# EAGLE design HB-OU-MP3-LED_V1.0 (EAGLE 9.3.1)
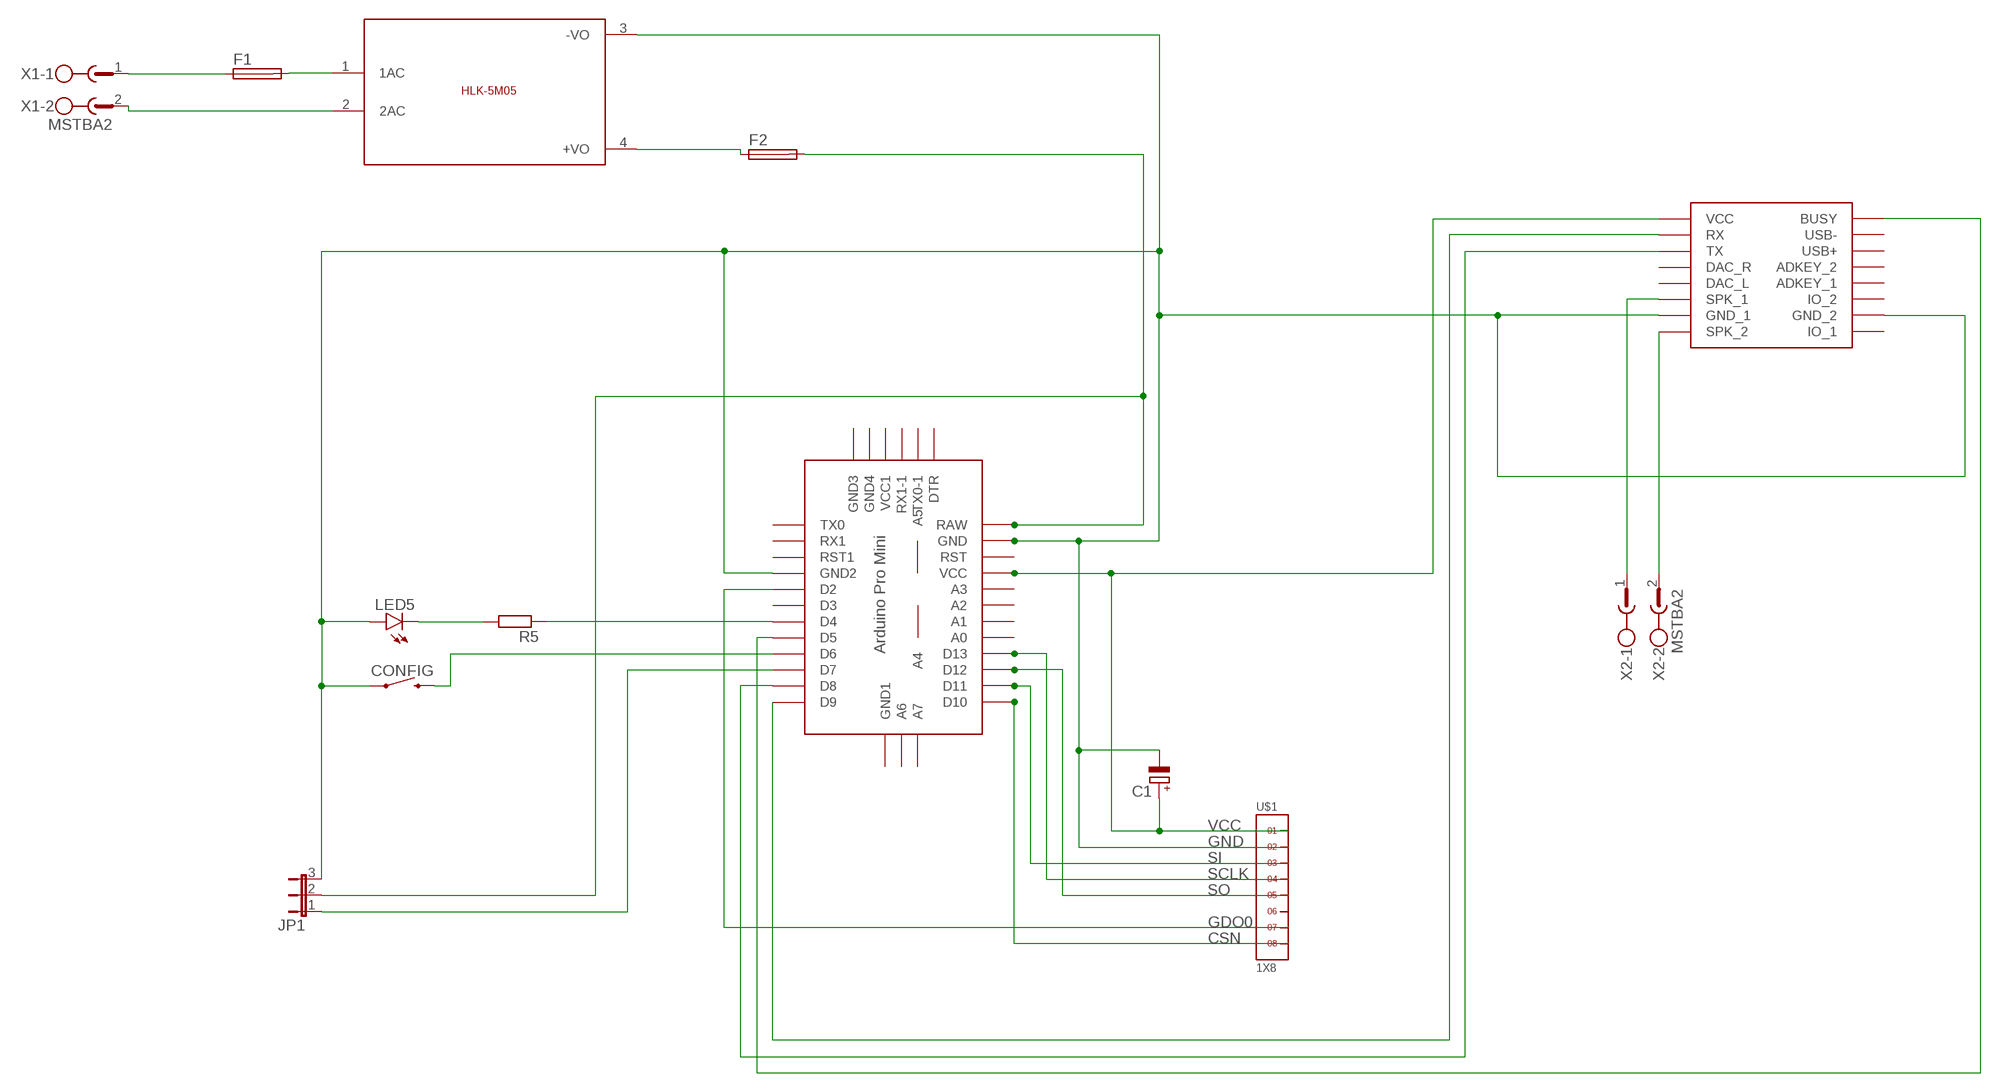
[diagram p0: schematic, sheet 1]

## Parts
C1  CPOL-EUE2.5-5  [E2,5-5]
CONFIG  MOMENTARY-SWITCH-SPST-PTH-6.0MM-KIT  [TACTILE_SWITCH_PTH_6.0MM_KIT]
F1  SH22,5A  [SH22,5A]
F2  SH22,5A  [SH22,5A]
JP1  JP2E  [JP2]
LED5  LED3MM  [LED3MM]
R5  R-EU_0309/10  [0309/10]
U$1  1X8  [1X8]
U$2  ABK-PRO-MINI  [ABK-PRO-MINI]
U$3  5VDC/5W  HLK-5M05  [HLK-5M05]
U$4  DFPLAYER  [DFPLAYER]
X1  MSTBA2  [MSTBA2]
X2  MSTBA2  [MSTBA2]

## Nets
CSN: U$1.8 U$2.D10
GDO0: U$1.7 U$2.D2
GND: C1.- CONFIG.1 JP1.3 LED5.A U$1.2 U$2.GND U$2.GND1(GND2) U$3.3(-VO) U$4.GND_1 U$4.GND_2
N$1: JP1.1 U$2.D7
N$2: CONFIG.3 U$2.D6
N$3: U$2.D9 U$4.RX
N$4: U$2.D8 U$4.TX
N$5: U$2.D5 U$4.BUSY
N$6: U$4.SPK1(SPK_1) X2.1
N$7: U$4.SPK2(SPK_2) X2.2
N$9: F1.1 X1.1
N$10: F2.1 U$3.4(+VO)
N$11: U$3.2(2AC) X1.2
N$17: R5.1 U$2.D4
N$18: LED5.K(C) R5.2
N$19: F1.2 U$3.1(1AC)
N$24: F2.2 JP1.2 U$2.RAW
SCLK: U$1.4 U$2.D13
SI: U$1.3 U$2.D11
SO: U$1.5 U$2.D12
VCC: C1.+ U$1.1 U$2.VCC U$4.VCC
Unconnected: U$1.6 U$2.A0 U$2.A1 U$2.A2 U$2.A3 U$2.A4 U$2.A5 U$2.A6 U$2.A7 U$2.D3 U$2.DTR U$2.GND2(GND3) U$2.GND3(GND4) U$2.GND4(GND1) U$2.RST U$2.RST1 U$2.RX1 U$2.RX1-1 U$2.TX0 U$2.TX0-1 U$2.VCC1 U$4.ADKEY1(ADKEY_1) U$4.ADKEY2(ADKEY_2) U$4.DAC_L U$4.DAC_R U$4.IO1(IO_1) U$4.IO2(IO_2) U$4.USB+ U$4.USB-

## Library data of the parts
C1 = resistor:CPOL-EU: POLARIZED CAPACITOR, European symbol
CONFIG = SparkFun-Switches:MOMENTARY-SWITCH-SPST: Momentary Switch (Pushbutton) - SPST Normally-open (NO) SPST momentary switches (buttons, pushbuttons). Variants PTH-12MM - 12mm square, through-hole Momentary Pushbutton Switch - 12mm Square <https://www.sparkfun.com/products/9190> (COM-09190) PTH-6.0MM, PTH-6.0MM-KIT - 6.0mm square, through-hole Mini Pushbutton Switch <https://www.sparkfun.com/products/97> (COM-00097) KIT package intended for soldering kit's - only one side of pads' copper is exposed. PTH-RIGHT-ANGLE-KIT - Right-angle, through-hole Right Angle Tactile Button <https://www.sparkfun.com/products/10791> - Used on SparkFun BigTime Watch Kit <https://www.sparkfun.com/products/11734> SMD-12MM - 12mm square, surface-mount Tactile Button - SMD (12mm) <https://www.sparkfun.com/products/12993> (COM-12993) Used on SparkFun PicoBoard <https://www.sparkfun.com/products/11888> SMD-4.5MM - 4.5mm Square Trackball Switch Used on SparkFun Blackberry Trackballer Breakout <https://www.sparkfun.com/products/13169> SMD-4.6MMX2.8MM - 4.60mm x 2.80mm, surface mount Used on SparkFun SAMD21 Mini Breakout <https://www.sparkfun.com/products/13664> SMD-5.2MM, SMD-5.2-REDUNDANT - 5.2mm square, surface-mount Mini Pushbutton Switch - SMD <https://www.sparkfun.com/products/8720> (COM-08720) Used on Arduino Pro Mini <https://www.sparkfun.com/products/11114> REDUNDANT package connects both switch circuits together SMD-6.0X3.5MM - 6.0 x 3.5mm, surface mount Momentary Reset Switch SMD <https://www.sparkfun.com/products/8229> (COM-08229) SMD-6.2MM-TALL - 6.2mm square, surface mount Tactile Button - SMD (6mm) <https://www.sparkfun.com/products/12992> Used on SparkFun Digital Sandbox <https://www.sparkfun.com/products/12651> SMD-RIGHT-ANGLE - Right-angle, surface mount Used on SparkFun Block for Intel® Edison - Arduino <https://www.sparkfun.com/products/13036>; PROD_ID: SWCH-08441; SF_SKU: COM-00097
F1 F2 = fuse:SH22,5A: FUSE HOLDER grid 22,5mm, isolated cap OGN0031 8201, Schurter (Buerklin); MPN: 0031.7701.11; OC_FARNELL: unknown; OC_NEWARK: 04F1224
JP1 = jumper:JP2E: JUMPER
LED5 = led:LED: LED OSRAM: - CHIPLED LG R971, LG N971, LY N971, LG Q971, LY Q971, LO R971, LY R971 LH N974, LH R974 LS Q976, LO Q976, LY Q976 LO Q996 - Hyper CHIPLED LW Q18S LB Q993, LB Q99A, LB R99A - SideLED LS A670, LO A670, LY A670, LG A670, LP A670 LB A673, LV A673, LT A673, LW A673 LH A674 LY A675 LS A676, LA A676, LO A676, LY A676, LW A676 LS A679, LY A679, LG A679 - Hyper Micro SIDELED® LS Y876, LA Y876, LO Y876, LY Y876 LT Y87S - SmartLED LW L88C, LW L88S LB L89C, LB L89S, LG L890 LS L89K, LO L89K, LY L89K LS L896, LA L896, LO L896, LY L896 - TOPLED LS T670, LO T670, LY T670, LG T670, LP T670 LSG T670, LSP T670, LSY T670, LOP T670, LYG T670 LG T671, LOG T671, LSG T671 LB T673, LV T673, LT T673, LW T673 LH T674 LS T676, LA T676, LO T676, LY T676, LB T676, LH T676, LSB T676, LW T676 LB T67C, LV T67C, LT T67C, LS T67K, LO T67K, LY T67K, LW E67C LS E67B, LA E67B, LO E67B, LY E67B, LB E67C, LV E67C, LT E67C LW T67C LS T679, LY T679, LG T679 LS T770, LO T770, LY T770, LG T770, LP T770 LB T773, LV T773, LT T773, LW T773 LH T774 LS E675, LA E675, LY E675, LS T675 LS T776, LA T776, LO T776, LY T776, LB T776 LHGB T686 LT T68C, LB T68C - Hyper Mini TOPLED® LB M676 - Mini TOPLED Santana® LG M470 LS M47K, LO M47K, LY M47K Source: http://www.osram.convergy.de LUXEON: - LUMILED® LXK2-PW12-R00, LXK2-PW12-S00, LXK2-PW14-U00, LXK2-PW14-V00 LXK2-PM12-R00, LXK2-PM12-S00, LXK2-PM14-U00 LXK2-PE12-Q00, LXK2-PE12-R00, LXK2-PE12-S00, LXK2-PE14-T00, LXK2-PE14-U00 LXK2-PB12-K00, LXK2-PB12-L00, LXK2-PB12-M00, LXK2-PB14-N00, LXK2-PB14-P00, LXK2-PB14-Q00 LXK2-PR12-L00, LXK2-PR12-M00, LXK2-PR14-Q00, LXK2-PR14-R00 LXK2-PD12-Q00, LXK2-PD12-R00, LXK2-PD12-S00 LXK2-PH12-R00, LXK2-PH12-S00 LXK2-PL12-P00, LXK2-PL12-Q00, LXK2-PL12-R00 Source: www.luxeon.com KINGBRIGHT: KA-3528ASYC Source: www.kingbright.com
R5 = resistor:R-EU_: RESISTOR, European symbol
U$1 = headers(2mm):1X8
U$2 = Arduino-clone:ABK-PRO-MINI: ABK Pro-Mini Arduino Clone
U$3 = HLK-5M05:HLK-5M05: HLK-5M05 is an 5Volt/5W smps developed by HI-LINK; SIZE: 23x38(mm)
U$4 = DFPlayer_v1:DFPLAYER
X1 X2 = con-phoenix-508:MSTBA2: PHOENIX; MF: FARNELL; MPN: 1757242; OC_FARNELL: 3705171; OC_NEWARK: 71C4161

## Board
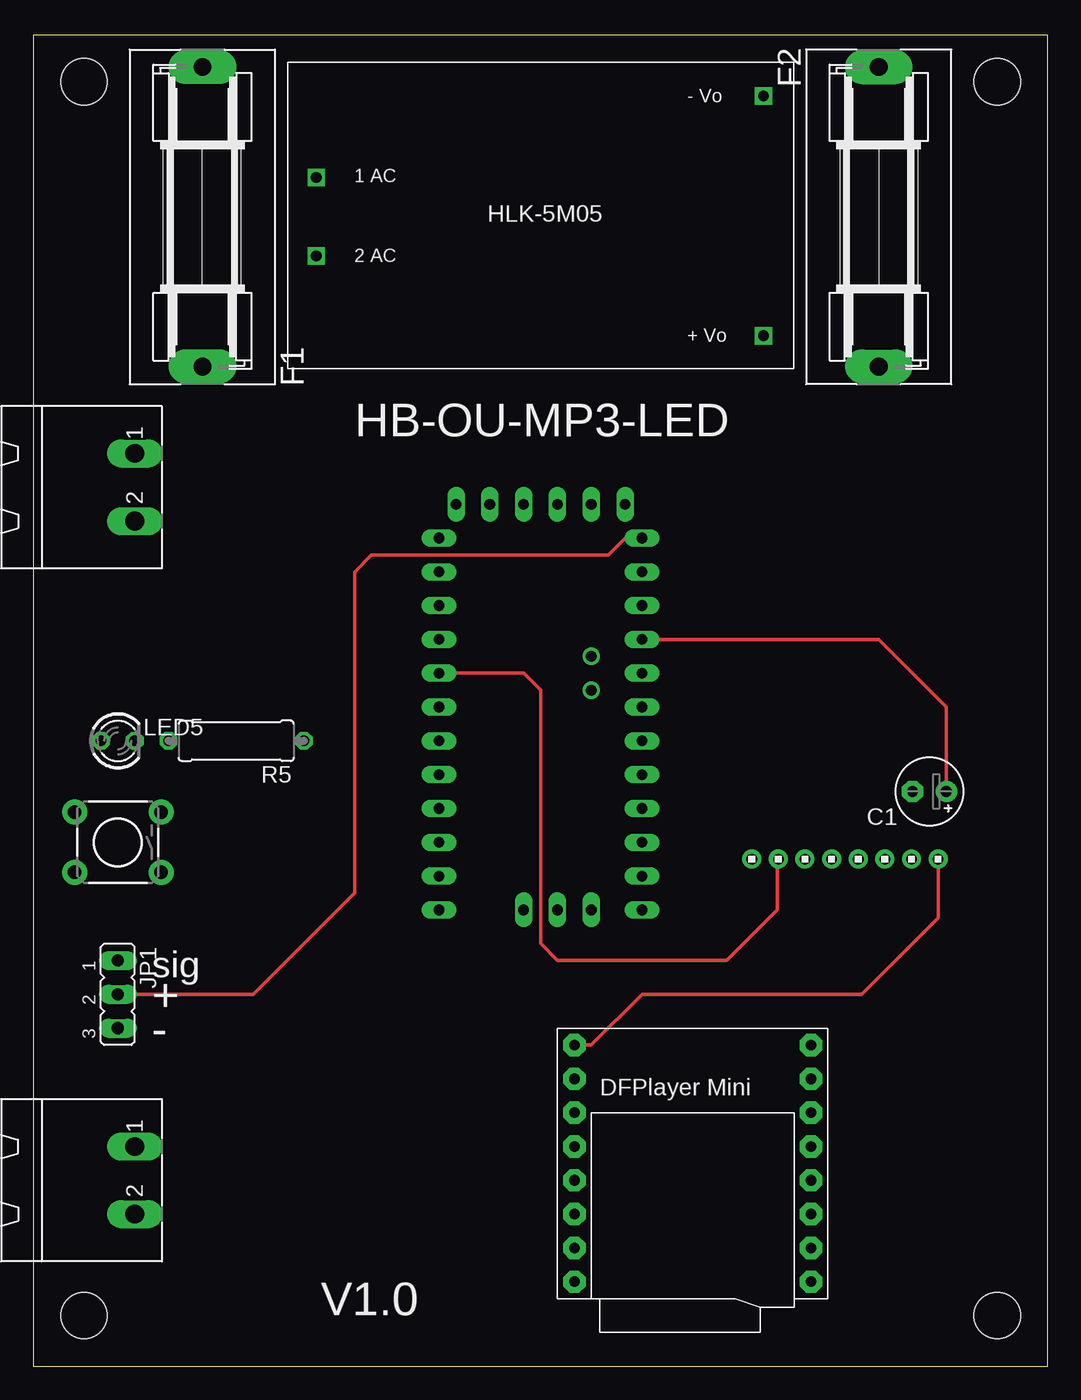
[diagram p1: board, top side]
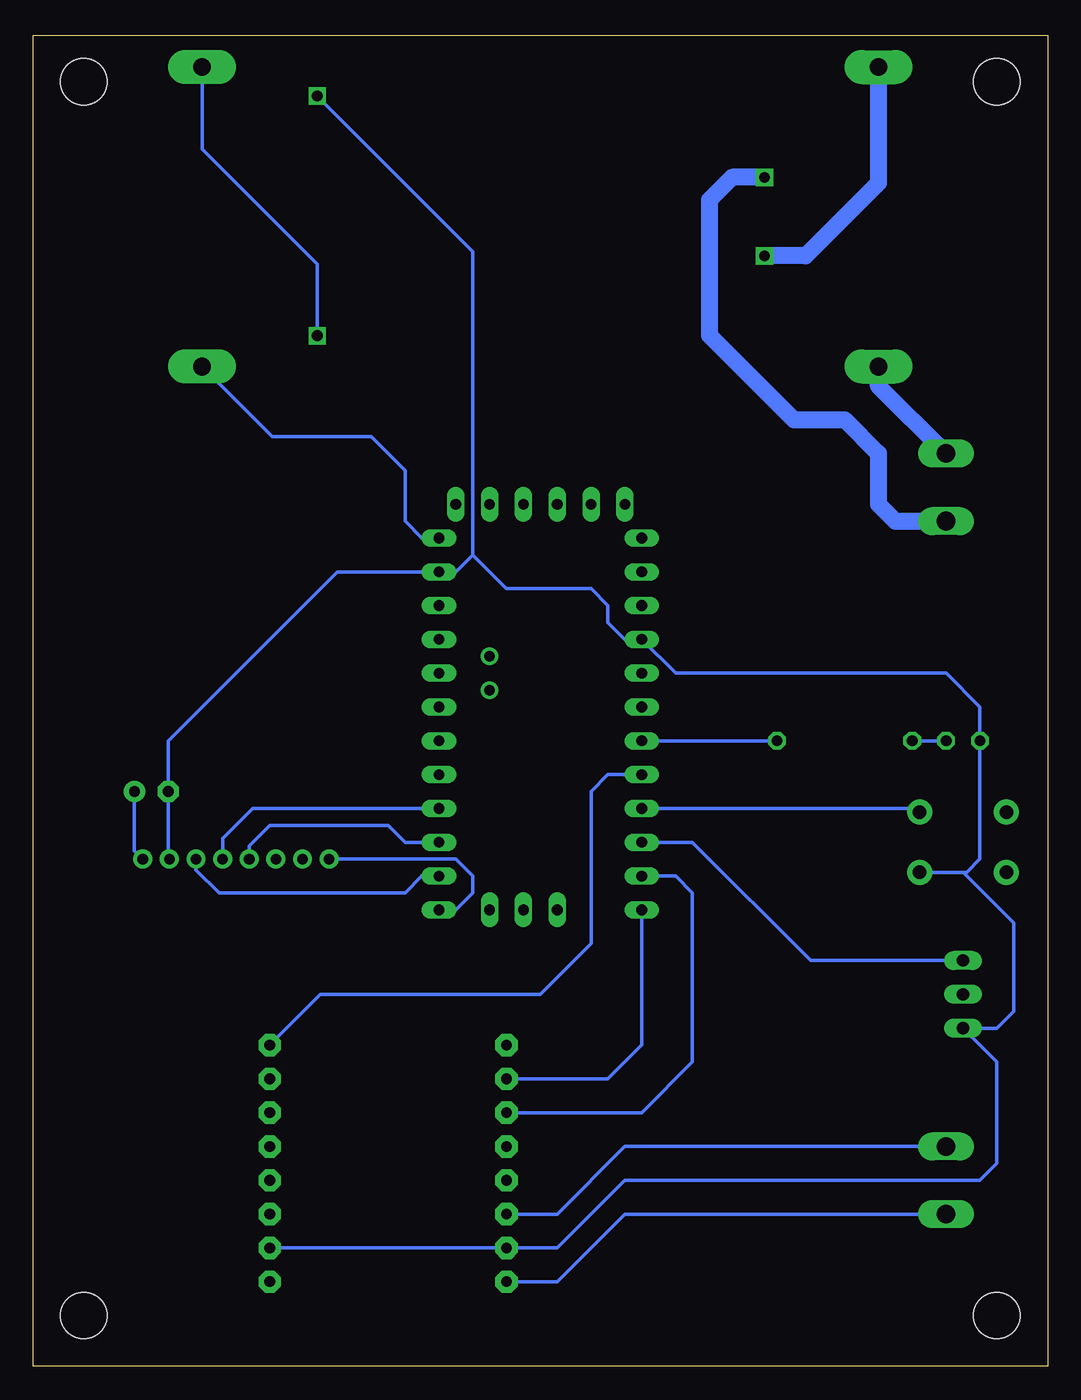
[diagram p2: board, bottom side, seen from below]

Size 76.18 x 100 mm. Coordinates in mm from the lower left corner, seen from the top.
Outline: 0,0 76.18,0 76.18,100 0,100 0,0
Copper layers (1*16): Top 0.035mm / dielectric 1.5mm / Bottom 0.035mm
Design rules "default": minimum track width 6mil, minimum drill 0.35mm, track to track 6mil, track to pad 6mil, pad to pad 6mil, via to via 6mil, smd to smd 6mil, copper to edge 40mil, drill to drill 6mil, minimum pad ring 10mil, minimum via ring 8mil, stop-mask expansion 4mil, vias tented up to drill 0mil, thermal gap 10mil
Holes 3.5 mm at 3.81,96.52 72.39,96.52 3.81,3.81 72.39,3.81

### Footprints (pad centres in the part's own frame; a part is rotated, then mirrored left to right if it is on the bottom)
E2,5-5 = drill 0.813 pad 1.6: + -1.27,0 | drill 0.813 pad 1.6 octagon: - 1.27,0
TACTILE_SWITCH_PTH_6.0MM_KIT = drill 1.016 pad 1.88: 1 -3.251,2.261; 2 3.251,2.261; 3 -3.251,-2.261; 4 3.251,-2.261
SH22,5A = drill 1.321 pad 2.54 long: 1 -11.252,0; 2 11.252,0
JP2 = drill 0.914 long: 1 -2.54,0; 2 0,0; 3 2.54,0
LED3MM = drill 0.813 octagon: A -1.27,0; K 1.27,0
0309/10 = drill 0.813 octagon: 1 -5.08,0; 2 5.08,0
1X8 = drill 0.8 pad 1.422: 1 -7,0; 2 -5,0; 3 -3,0; 4 -1,0; 5 1,0; 6 3,0; 7 5,0; 8 7,0
ABK-PRO-MINI = drill 0.8 long: A0 10.16,-3.81; A1 10.16,-6.35; A2 10.16,-8.89; A3 10.16,-11.43; A6 3.81,-21.59; A7 6.35,-21.59; D2 -5.08,-3.81; D3 -5.08,-6.35; D4 -5.08,-8.89; D5 -5.08,-11.43; D6 -5.08,-13.97; D7 -5.08,-16.51; D8 -5.08,-19.05; D9 -5.08,-21.59; D10 10.16,-21.59; D11 10.16,-19.05; D12 10.16,-16.51; D13 10.16,-13.97; DTR 8.89,8.89; GND 10.16,3.81; GND1 -5.08,-1.27; GND2 -3.81,8.89; GND3 -1.27,8.89; GND4 1.27,-21.59; RAW 10.16,6.35; RST 10.16,1.27; RST1 -5.08,1.27; RX1 -5.08,3.81; RX1-1 3.81,8.89; TX0 -5.08,6.35; TX0-1 6.35,8.89; VCC 10.16,-1.27; VCC1 1.27,8.89 | drill 0.8: A4 6.35,-5.08; A5 6.35,-2.54
HLK-5M05 = drill 0.8 square: 1 -16.85,-2.93; 2 -16.85,2.97; 3 16.75,9.07; 4 16.75,-8.93
DFPLAYER = drill 0.8 pad 1.676 octagon: ADKEY1 8.89,-1.27; ADKEY2 8.89,1.27; BUSY 8.89,8.89; DAC_L -8.89,-1.27; DAC_R -8.89,1.27; GND_1 -8.89,-6.35; GND_2 8.89,-6.35; IO1 8.89,-8.89; IO2 8.89,-3.81; RX -8.89,6.35; SPK1 -8.89,-3.81; SPK2 -8.89,-8.89; TX -8.89,3.81; USB+ 8.89,3.81; USB- 8.89,6.35; VCC -8.89,8.89
MSTBA2 = drill 1.397 long: 1 -2.54,5.08; 2 2.54,5.08

### Placement (x,y rotation side)
C1  67.31,43.18 180 top
CONFIG  6.35,39.37 180 top
F1  12.7,86.36 90 top
F2  63.5,86.36 270 top
JP1  6.35,27.94 270 top
LED5  6.35,46.99 0 top
R5  15.24,46.99 180 top
U$1  60.96,38.1 180 top
U$2  35.56,55.88 0 top
U$3  38.1,86.36 0 top
U$4  49.53,15.24 0 top
X1  2.54,66.04 270 top
X2  2.54,13.97 270 top

### Tracks (layer width: path | path; a pad name or v marks a point on that pad's centre or on a via)
CSN
  Bottom 0.254: U$2.D10 44.45,34.29 43.18,35.56 43.18,36.83 44.45,38.1 U$1.8
GDO0
  Top 0.254: U$1.7 55.88,38.02 55.88,34.29 52.07,30.48 39.37,30.48 38.1,31.75 38.1,50.8 36.83,52.07 U$2.D2
GND
  Bottom 0.254: U$4.GND_2 U$4.GND_1 36.83,8.89 31.75,13.97 5.08,13.97 3.81,15.24 3.81,22.86 JP1.3 3.81,25.4 2.54,26.67 2.54,33.3 6.35,37.11 | CONFIG.1 6.35,37.11 | 6.35,37.11 6.07,37.11 5.08,38.1 LED5.A 5.08,49.53 7.62,52.07 27.94,52.07 U$2.GND1 31.75,54.61 33.02,55.88 33.02,57.15 34.29,58.42 40.64,58.42 43.18,60.96 | U$3.3 43.18,83.76 43.18,60.96 | 43.18,60.96 44.45,59.69 U$2.GND 53.34,59.69 66.04,46.99 C1.- 66.04,38.18 U$1.2
N$1
  Bottom 0.254: U$2.D7 26.67,39.37 17.78,30.48 JP1.1
N$2
  Bottom 0.254: CONFIG.3 9.88,41.91 U$2.D6
N$3
  Bottom 0.254: U$2.D9 30.48,24.13 33.02,21.59 U$4.RX
N$4
  Bottom 0.254: U$2.D8 27.94,36.83 26.67,35.56 26.67,22.86 30.48,19.05 U$4.TX
N$5
  Bottom 0.254: U$4.BUSY 54.61,27.94 38.1,27.94 34.29,31.75 34.29,43.18 33.02,44.45 U$2.D5
N$6
  Bottom 0.254: X2.1 31.75,16.51 36.83,11.43 U$4.SPK1
N$7
  Bottom 0.254: X2.2 31.75,11.43 36.83,6.35 U$4.SPK2
N$9
  Bottom 1.27: X1.1 12.7,73.66 F1.1
N$10
  Bottom 0.254: U$3.4 54.85,82.79 63.5,91.44 F2.1
N$11
  Bottom 1.27: U$3.2 23.7,89.33 25.4,87.63 25.4,77.47 19.05,71.12 15.24,71.12 12.7,68.58 12.7,64.77 11.43,63.5 X1.2
N$17
  Bottom 0.254: R5.1 U$2.D4
N$18
  Bottom 0.254: LED5.K R5.2
N$19
  Bottom 1.27: F1.2 12.7,88.9 18.17,83.43 U$3.1
N$24
  Top 0.254: JP1.2 16.51,27.94 24.13,35.56 24.13,59.69 25.4,60.96 43.18,60.96 44.45,62.23 U$2.RAW
  Bottom 0.254: F2.2 58.24,69.85 50.8,69.85 48.26,67.31 48.26,63.5 46.99,62.23 U$2.RAW
SCLK
  Bottom 0.254: U$2.D13 59.69,41.91 61.96,39.64 U$1.4
SI
  Bottom 0.254: U$2.D11 46.99,36.83 48.26,35.56 62.23,35.56 63.96,37.29 U$1.3
SO
  Bottom 0.254: U$2.D12 48.26,39.37 49.53,40.64 58.42,40.64 59.96,39.1 U$1.5
VCC
  Top 0.254: U$1.1 67.96,33.67 62.23,27.94 45.72,27.94 41.91,24.13 U$4.VCC | U$2.VCC 63.5,54.61 68.58,49.53 C1.+
  Bottom 0.254: C1.+ 68.58,38.72 U$1.1

### Text on the board
tNames: HB-OU-MP3-LED | sig | + | - | V1.0